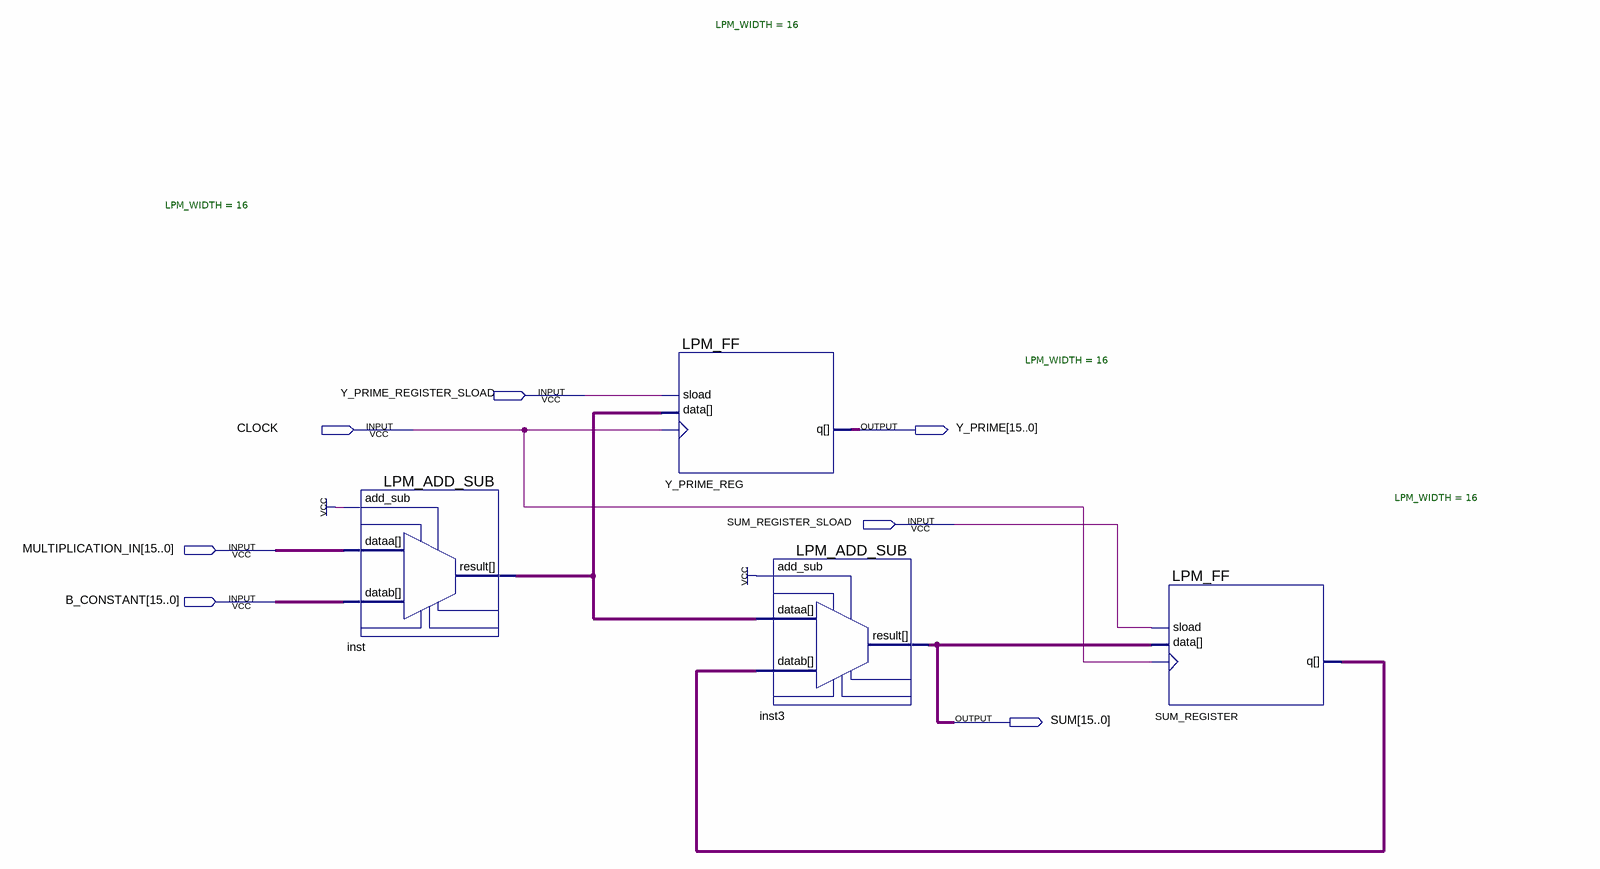
[diagram p0: schematic sheet]
// Quartus schematic RNDC_FINAL_Y_AND_FINAL_SUM_CALCULATOR.bdf as structural Verilog: 4 symbols, 7 pins
module RNDC_FINAL_Y_AND_FINAL_SUM_CALCULATOR (
  input  Y_PRIME_REGISTER_SLOAD,
  input  CLOCK,
  input  SUM_REGISTER_SLOAD,
  input  [15:0] MULTIPLICATION_IN,
  input  [15:0] B_CONSTANT,
  output [15:0] Y_PRIME,
  output [15:0] SUM
);

  wire [15:0] inst_result, SUM_REGISTER_q;

  LPM_ADD_SUB #(.LPM_WIDTH(16)) inst (
    .add_sub(1'b1), .dataa(MULTIPLICATION_IN), .datab(B_CONSTANT), .result(inst_result));
  LPM_FF #(.LPM_WIDTH(16)) Y_PRIME_REG (.clock(CLOCK), .data(inst_result), .sload(Y_PRIME_REGISTER_SLOAD), .q(Y_PRIME));
  LPM_ADD_SUB #(.LPM_WIDTH(16)) inst3 (.add_sub(1'b1), .dataa(inst_result), .datab(SUM_REGISTER_q), .result(SUM));
  LPM_FF #(.LPM_WIDTH(16)) SUM_REGISTER (.clock(CLOCK), .data(SUM), .sload(SUM_REGISTER_SLOAD), .q(SUM_REGISTER_q));
endmodule
